# Altium schematic sheet LIMIT SWITCH.SchDoc
size A4
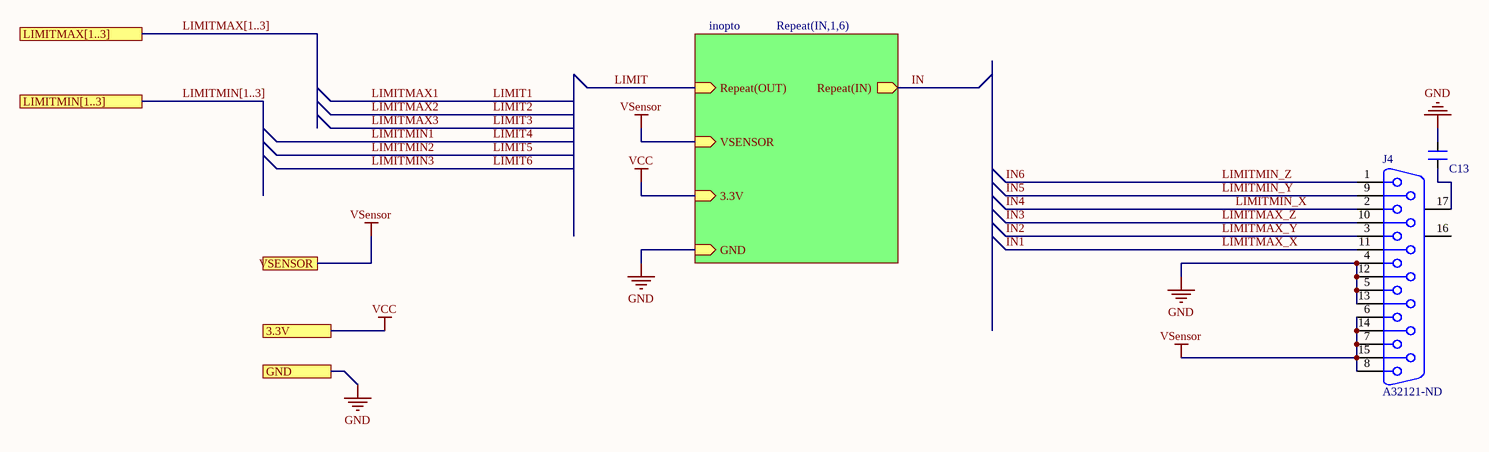
[diagram p0: LIMIT SWITCH.SchDoc]

## Parts
C13  CN  [CN-SMD-0603_big]  (value not drawn)
J4  A32121-ND  [DB15]

## Sub-sheets
Repeat(IN,1,6) = inopto: Repeat(OUT) (in), Repeat(IN) (out), VSENSOR (in), 3.3V (in), GND (in)

## Ports
3.3V, GND, LIMITMAX[1..3], LIMITMIN[1..3], VSENSOR

## Nets
GND: C13.2 J4.4 J4.5 J4.12 J4.13 ; port GND, sheet Repeat(IN,1,6)/GND
VCC: port 3.3V, sheet Repeat(IN,1,6)/3.3V
VSensor: J4.6 J4.7 J4.8 J4.14 J4.15 ; port VSENSOR, sheet Repeat(IN,1,6)/VSENSOR
IN: sheet Repeat(IN,1,6)/Repeat(IN)
IN1: J4.11  [also labelled LIMITMAX_X]
IN2: J4.3  [also labelled LIMITMAX_Y]
IN3: J4.10  [also labelled LIMITMAX_Z]
IN4: J4.2  [also labelled LIMITMIN_X]
IN5: J4.9  [also labelled LIMITMIN_Y]
IN6: J4.1  [also labelled LIMITMIN_Z]
LIMIT: sheet Repeat(IN,1,6)/Repeat(OUT)
NetC13_1: C13.1 J4.17(MH2)

Not connected (* = marked no-connect by the designer): J4 16(MH1)

## Buses and harness runs
bus LIMITMAX[1..3] = port LIMITMAX[1..3]
bus LIMITMIN[1..3] = port LIMITMIN[1..3]

## Library data of the parts
C13 = CN: Value: 33pF
J4 = DB15: Receptacle Assembly, 15 Position, Right Angle; PackageDocument: O; Positions: 15; Published: 15-Jun-2001; LatestRevisionDate: 17-Jul-2002; LatestRevisionNote: Re-released for DXP Platform.; DatasheetDocument: 1-Sep-99; PackageReference: 788757; Publisher: Altium Limited; Orientation: Right Angle; Gender: Receptacle